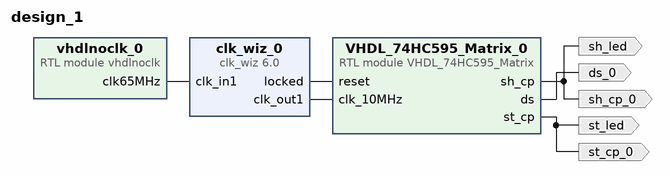
[diagram p0: block diagram of the top level]
# Vivado block design design_1, xc7z007sclg225-1, Vivado 2019.2
create_bd_design design_1

create_bd_port -dir O sh_cp_0
create_bd_port -dir O st_cp_0
create_bd_port -dir O ds_0
create_bd_port -dir O st_led
create_bd_port -dir O sh_led

create_bd_cell -type ip -vlnv xilinx.com:ip:clk_wiz:6.0 clk_wiz_0
set_property -dict [list \
  CONFIG.CLKIN1_JITTER_PS 153.84 \
  CONFIG.CLKOUT1_JITTER 327.011 \
  CONFIG.CLKOUT1_PHASE_ERROR 139.555 \
  CONFIG.CLKOUT1_REQUESTED_OUT_FREQ 5 \
  CONFIG.MMCM_CLKFBOUT_MULT_F 9.750 \
  CONFIG.MMCM_CLKIN1_PERIOD 15.385 \
  CONFIG.MMCM_CLKIN2_PERIOD 10.000 \
  CONFIG.MMCM_CLKOUT0_DIVIDE_F 126.750 \
  CONFIG.PRIM_IN_FREQ 65.000 \
  CONFIG.USE_LOCKED true \
  CONFIG.USE_RESET false \
] [get_bd_cells clk_wiz_0]
create_bd_cell -type module -reference vhdlnoclk vhdlnoclk_0
create_bd_cell -type module -reference VHDL_74HC595_Matrix VHDL_74HC595_Matrix_0

# ---- connections ----

connect_bd_net [get_bd_pins vhdlnoclk_0/clk65MHz] [get_bd_pins clk_wiz_0/clk_in1]
connect_bd_net [get_bd_pins clk_wiz_0/locked] [get_bd_pins VHDL_74HC595_Matrix_0/reset]
connect_bd_net [get_bd_pins VHDL_74HC595_Matrix_0/sh_cp] [get_bd_ports sh_cp_0] [get_bd_ports sh_led]
connect_bd_net [get_bd_pins VHDL_74HC595_Matrix_0/st_cp] [get_bd_ports st_cp_0] [get_bd_ports st_led]
connect_bd_net [get_bd_pins VHDL_74HC595_Matrix_0/ds] [get_bd_ports ds_0]
connect_bd_net [get_bd_pins clk_wiz_0/clk_out1] [get_bd_pins VHDL_74HC595_Matrix_0/clk_10MHz]

validate_bd_design
save_bd_design
